# Altium schematic sheet TCA785-V.SchDoc
size A; SheetNumber: 2; SheetTotal: 4
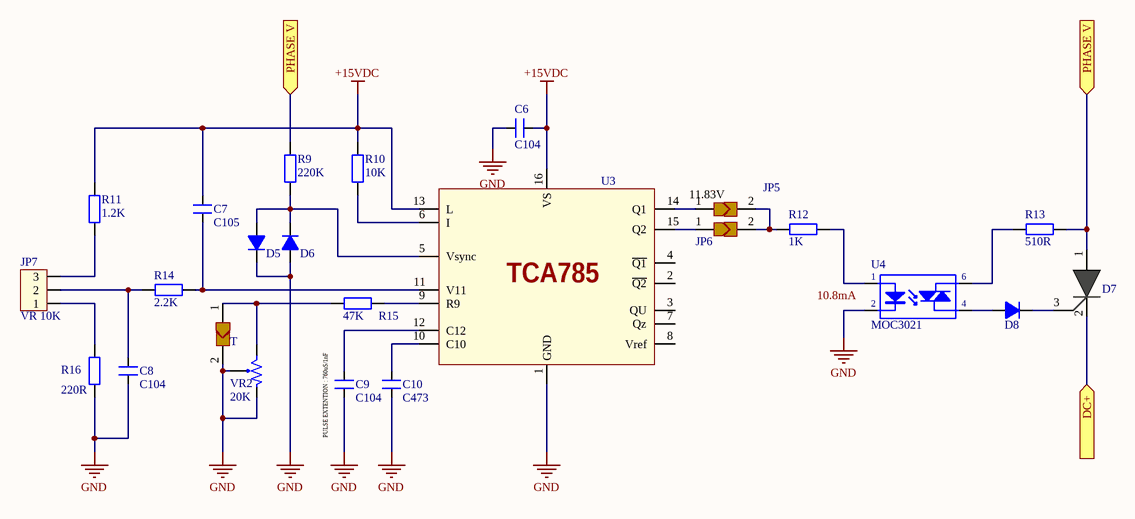
[diagram p0: TCA785-V.SchDoc]

## Parts
C6  C104  [CN2-O]
C7  C105  [CN2-O]
C8  C104  [CN2-O]
C9  C104  [CN2-O]
C10  C473  [CN2-O]
D5  Diode  1N4007  [DO41-1A]  (value not drawn)
D6  Diode  1N4007  [DO41-1A]  (value not drawn)
D7  SCR  [TO-220]  (value not drawn)
D8  Diode  1N4007  [DO41-1A]  (value not drawn)
JP5  PAD_Sellect  [PAD Select]  (value not drawn)
JP6  PAD_Sellect  [PAD Select]  (value not drawn)
JP7  VR 10K  [CON3]
R9  220K  [R1/4W]
R10  10K  [R1/4W]
R11  1.2K  [R1/4W]
R12  1K  [R1/4W]
R13  510R  [R1/4W]
R14  2.2K  [R1/4W]
R15  47K  [R1/4W]
R16  220R  [R1/4W]
T  PAD_Sellect  [PAD Select]  (value not drawn)
U3  TCA785Q  [DIP-16]  (value not drawn)
U4  MOC3021  [DIP6/W0.3 - MOC3021]
VR2  20K  [VR]

## Ports
DC+ (in), PHASE V (in)

## Nets
+15VDC: C6.2 C7.2 R10.1 R11.2 U3.13(L) U3.16(VS)
GND: C6.1 C8.1 C9.1 C10.1 D5.2 D6.1 R16.1 T.2 U3.1(GND) U4.2(K) VR2.1 VR2.2
DC+: D7.2(K) ; port DC+
PHASE V: D7.1(A) R9.1 R13.1 ; port PHASE V
NetC7_1: C7.1 R14.1 U3.11(V11)
NetC8_2: C8.2 JP7.2 R14.2
NetC9_2: C9.2 U3.12(C12)
NetC10_2: C10.2 U3.10(C10)
NetD5_1: D5.1 D6.2 R9.2 U3.5(Vsync)
NetD7_3: D7.3(G) D8.2
NetD8_1: D8.1 U4.4(E)
NetJP5_1: JP5.1 U3.14(Q1)
NetJP5_2: JP5.2 JP6.2 R12.2
NetJP6_1: JP6.1 U3.15(Q2)
NetJP7_1: JP7.1 R16.2
NetJP7_3: JP7.3 R11.1
NetR10_2: R10.2 U3.6(I)
NetR12_1: R12.1 U4.1(A)
NetR13_2: R13.2 U4.6(C)
NetR15_1: R15.1 T.1 VR2.3
NetR15_2: R15.2 U3.9(R9)

Not connected (* = marked no-connect by the designer): U3 2(~{Q2}) 3(QU) 4(~{Q1}) 7(Qz) 8(Vref)

## Notes on the sheet
- (near JP5) 11.83V
- (near C9) PULSE EXTENTION : 760uS/1nF
- Labels drawn without touching a wire or pin: 10.8mA
- (in symbol TCA785Q) TCA785

## Library data of the parts
C6-C10 = CAP-gom: Value: 33pF
D5 D6 D8 = Diode  1N4007: Diode 1A; Value: 1N4007
D7 = BT151
JP7 = Con3: Connector 3; Value: Connector 3
R9-R16 = R1/4W: Resistor 1/4W; Value: R1/4W - 1K
U4 = MOC3021: Single Opto; Value: MOC3021
VR2 = VR: Var Resistor RM065; RM065-104: 10K; RM065-503: 5K; RM065-103: 1K